# EAGLE schematic ir03 (EAGLE 9.6.2)
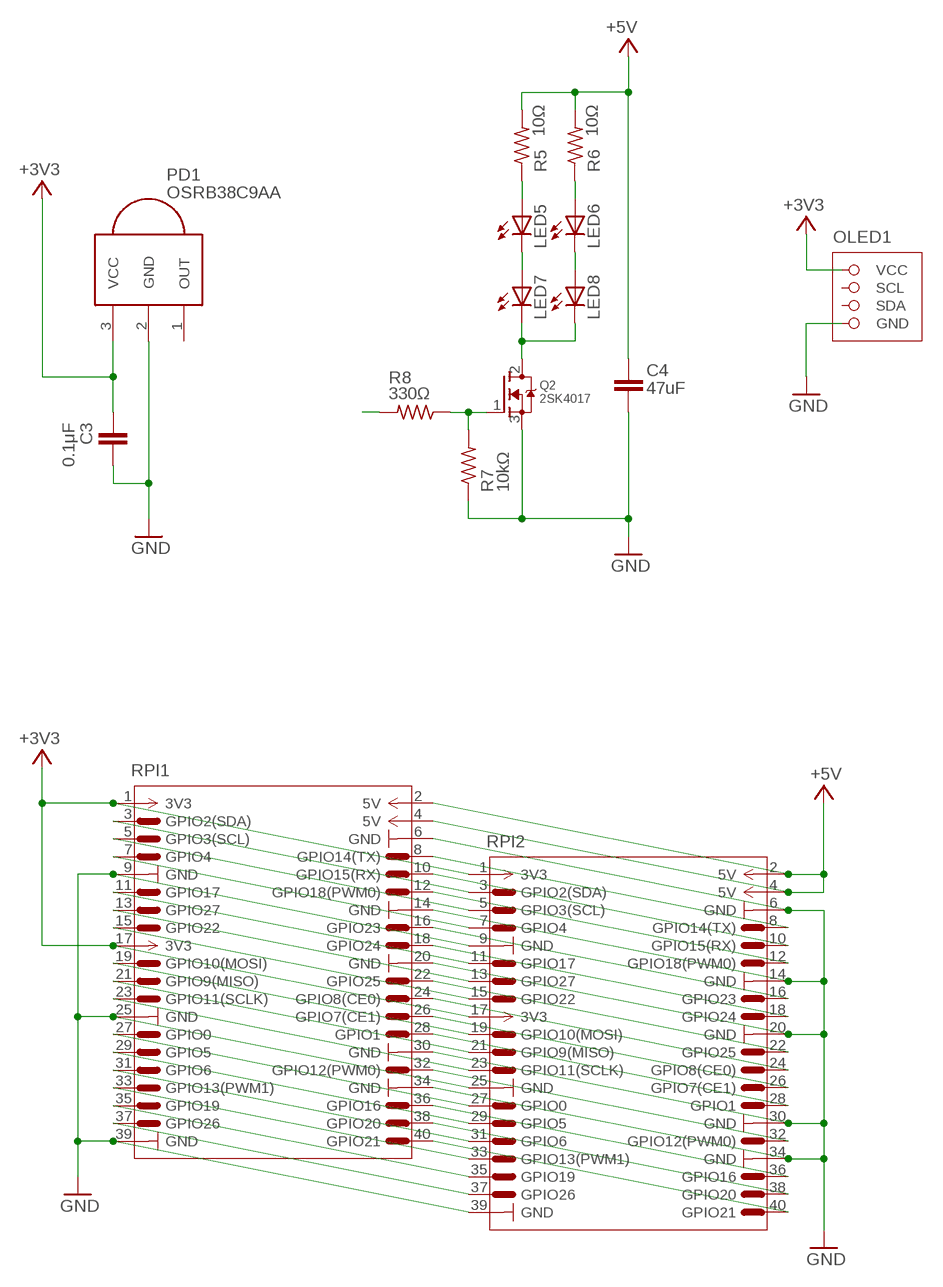
[diagram p0: schematic, sheet 1]

## Parts
C3  0.1μF  C-EU025-025X050  [C025-025X050]
C4  47uF  C-EU025-025X050  [C025-025X050]
LED5  LED3MM  [LED3MM]
LED6  LED3MM  [LED3MM]
LED7  LED3MM  [LED3MM]
LED8  LED3MM  [LED3MM]
OLED1  OLED-SSD1306-0.96  [OLED-I2C-0.96]
PD1  OSRB38C9AA  PNA460XM  [PNA460XM]
Q2  2SK4017  MOSFET-NGDS_TO220V  [TO220V]
R5  10Ω  R-US_0204/5  [0204/5]
R6  10Ω  R-US_0204/5  [0204/5]
R7  10kΩ  R-US_0204/5  [0204/5]
R8  330Ω  R-US_0204/5  [0204/5]
RPI1  RPI-PIN  [RPI-PIN]
RPI2  RPI-PIN  [RPI-PIN]

## Nets
+3V3: C3.1 OLED1.VCC PD1.3(VCC) RPI1.1(3V3) RPI1.17(3V3) RPI2.1(3V3) RPI2.17(3V3)
+5V: C4.1 R5.2 R6.2 RPI1.2(5V) RPI1.4(5V) RPI2.2(5V) RPI2.4(5V)
GND: C3.2 C4.2 OLED1.GND PD1.2(GND) Q2.3(S) R7.1 RPI1.6(GND) RPI1.9(GND) RPI1.14(GND) RPI1.20(GND) RPI1.25(GND) RPI1.30(GND) RPI1.34(GND) RPI1.39(GND) RPI2.6(GND) RPI2.9(GND) RPI2.14(GND) RPI2.20(GND) RPI2.25(GND) RPI2.30(GND) RPI2.34(GND) RPI2.39(GND)
N$2: LED5.A R5.1
N$3: RPI1.3(GPIO2(SDA)) RPI2.3(GPIO2(SDA))
N$11: RPI1.5(GPIO3(SCL)) RPI2.5(GPIO3(SCL))
N$15: RPI1.7(GPIO4) RPI2.7(GPIO4)
N$25: LED6.A R6.1
N$29: RPI1.11(GPIO17) RPI2.11(GPIO17)
N$30: RPI1.13(GPIO27) RPI2.13(GPIO27)
N$31: RPI1.15(GPIO22) RPI2.15(GPIO22)
N$33: RPI1.23(GPIO11(SCLK)) RPI2.23(GPIO11(SCLK))
N$36: RPI1.19(GPIO10(MOSI)) RPI2.19(GPIO10(MOSI))
N$46: RPI1.21(GPIO9(MISO)) RPI2.21(GPIO9(MISO))
N$47: LED5.K(C) LED7.A
N$49: LED6.K(C) LED8.A
N$50: LED7.K(C) LED8.K(C) Q2.2(D)
N$51: RPI1.8(GPIO14(TX)) RPI2.8(GPIO14(TX))
N$52: RPI1.10(GPIO15(RX)) RPI2.10(GPIO15(RX))
N$53: RPI1.12(GPIO18(PWM0)) RPI2.12(GPIO18(PWM0))
N$54: RPI1.16(GPIO23) RPI2.16(GPIO23)
N$55: RPI1.18(GPIO24) RPI2.18(GPIO24)
N$56: RPI1.22(GPIO25) RPI2.22(GPIO25)
N$57: Q2.1(G) R7.2 R8.1
N$58: R8.2
N$60: RPI1.24(GPIO8(CE0)) RPI2.24(GPIO8(CE0))
N$61: RPI1.26(GPIO7(CE1)) RPI2.26(GPIO7(CE1))
N$62: RPI1.27(GPIO0) RPI2.27(GPIO0)
N$63: RPI1.28(GPIO1) RPI2.28(GPIO1)
N$64: RPI1.29(GPIO5) RPI2.29(GPIO5)
N$65: RPI1.31(GPIO6) RPI2.31(GPIO6)
N$66: RPI1.32(GPIO12(PWM0)) RPI2.32(GPIO12(PWM0))
N$67: RPI1.33(GPIO13(PWM1)) RPI2.33(GPIO13(PWM1))
N$68: RPI1.35(GPIO19) RPI2.35(GPIO19)
N$69: RPI1.36(GPIO16) RPI2.36(GPIO16)
N$70: RPI1.37(GPIO26) RPI2.37(GPIO26)
N$71: RPI1.38(GPIO20) RPI2.38(GPIO20)
N$72: RPI1.40(GPIO21) RPI2.40(GPIO21)
Unconnected: OLED1.SCL OLED1.SDA PD1.1(OUT)

## Library data of the parts
C3 C4 = rcl:C-EU: CAPACITOR, European symbol; SPICEPREFIX: C
LED5-LED8 = adafruit:LED: LED OSRAM: - CHIPLED LG R971, LG N971, LY N971, LG Q971, LY Q971, LO R971, LY R971 LH N974, LH R974 LS Q976, LO Q976, LY Q976 LO Q996 - Hyper CHIPLED LW Q18S LB Q993, LB Q99A, LB R99A - SideLED LS A670, LO A670, LY A670, LG A670, LP A670 LB A673, LV A673, LT A673, LW A673 LH A674 LY A675 LS A676, LA A676, LO A676, LY A676, LW A676 LS A679, LY A679, LG A679 - Hyper Micro SIDELED® LS Y876, LA Y876, LO Y876, LY Y876 LT Y87S - SmartLED LW L88C, LW L88S LB L89C, LB L89S, LG L890 LS L89K, LO L89K, LY L89K LS L896, LA L896, LO L896, LY L896 - TOPLED LS T670, LO T670, LY T670, LG T670, LP T670 LSG T670, LSP T670, LSY T670, LOP T670, LYG T670 LG T671, LOG T671, LSG T671 LB T673, LV T673, LT T673, LW T673 LH T674 LS T676, LA T676, LO T676, LY T676, LB T676, LH T676, LSB T676, LW T676 LB T67C, LV T67C, LT T67C, LS T67K, LO T67K, LY T67K, LW E67C LS E67B, LA E67B, LO E67B, LY E67B, LB E67C, LV E67C, LT E67C LW T67C LS T679, LY T679, LG T679 LS T770, LO T770, LY T770, LG T770, LP T770 LB T773, LV T773, LT T773, LW T773 LH T774 LS E675, LA E675, LY E675, LS T675 LS T776, LA T776, LO T776, LY T776, LB T776 LHGB T686 LT T68C, LB T68C - Hyper Mini TOPLED® LB M676 - Mini TOPLED Santana® LG M470 LS M47K, LO M47K, LY M47K Source: http://www.osram.convergy.de/
OLED1 = ytani1:OLED-SSD1306-0.96: OLED SSD1306 0.96inch 128x96 I2C https://akizukidenshi.com/catalog/g/gP-12031/ Vcc: 3V-5.5V I2C addr: 0x3C Control chip: SSD1306 Blank/White; OC_AKIZUKI: P-12031; URL_AKIZUKI: https://akizukidenshi.com/catalog/g/gP-12031/
PD1 = adafruit:PNA460XM: IR 38KHz receiver PNA4602 and related receivers http://www.ladyada.net/library/pcb/eaglelibrary.html
Q2 = adafruit:MOSFET-N: N-Channel Mosfet 2N7002E - 60V 260mA SOT23 [Digikey: 2N7002ET1GOSTR-ND] - REEL BSH103 - 30V 850mA SOT23 [Digikey: 568-5013-1-ND]
R5-R8 = rcl:R-US_: RESISTOR, American symbol; SPICEPREFIX: R
RPI1 RPI2 = ytani1:RPI-PIN: Raspberry Pi pin header